# EAGLE design untitled (EAGLE 9.6.2)
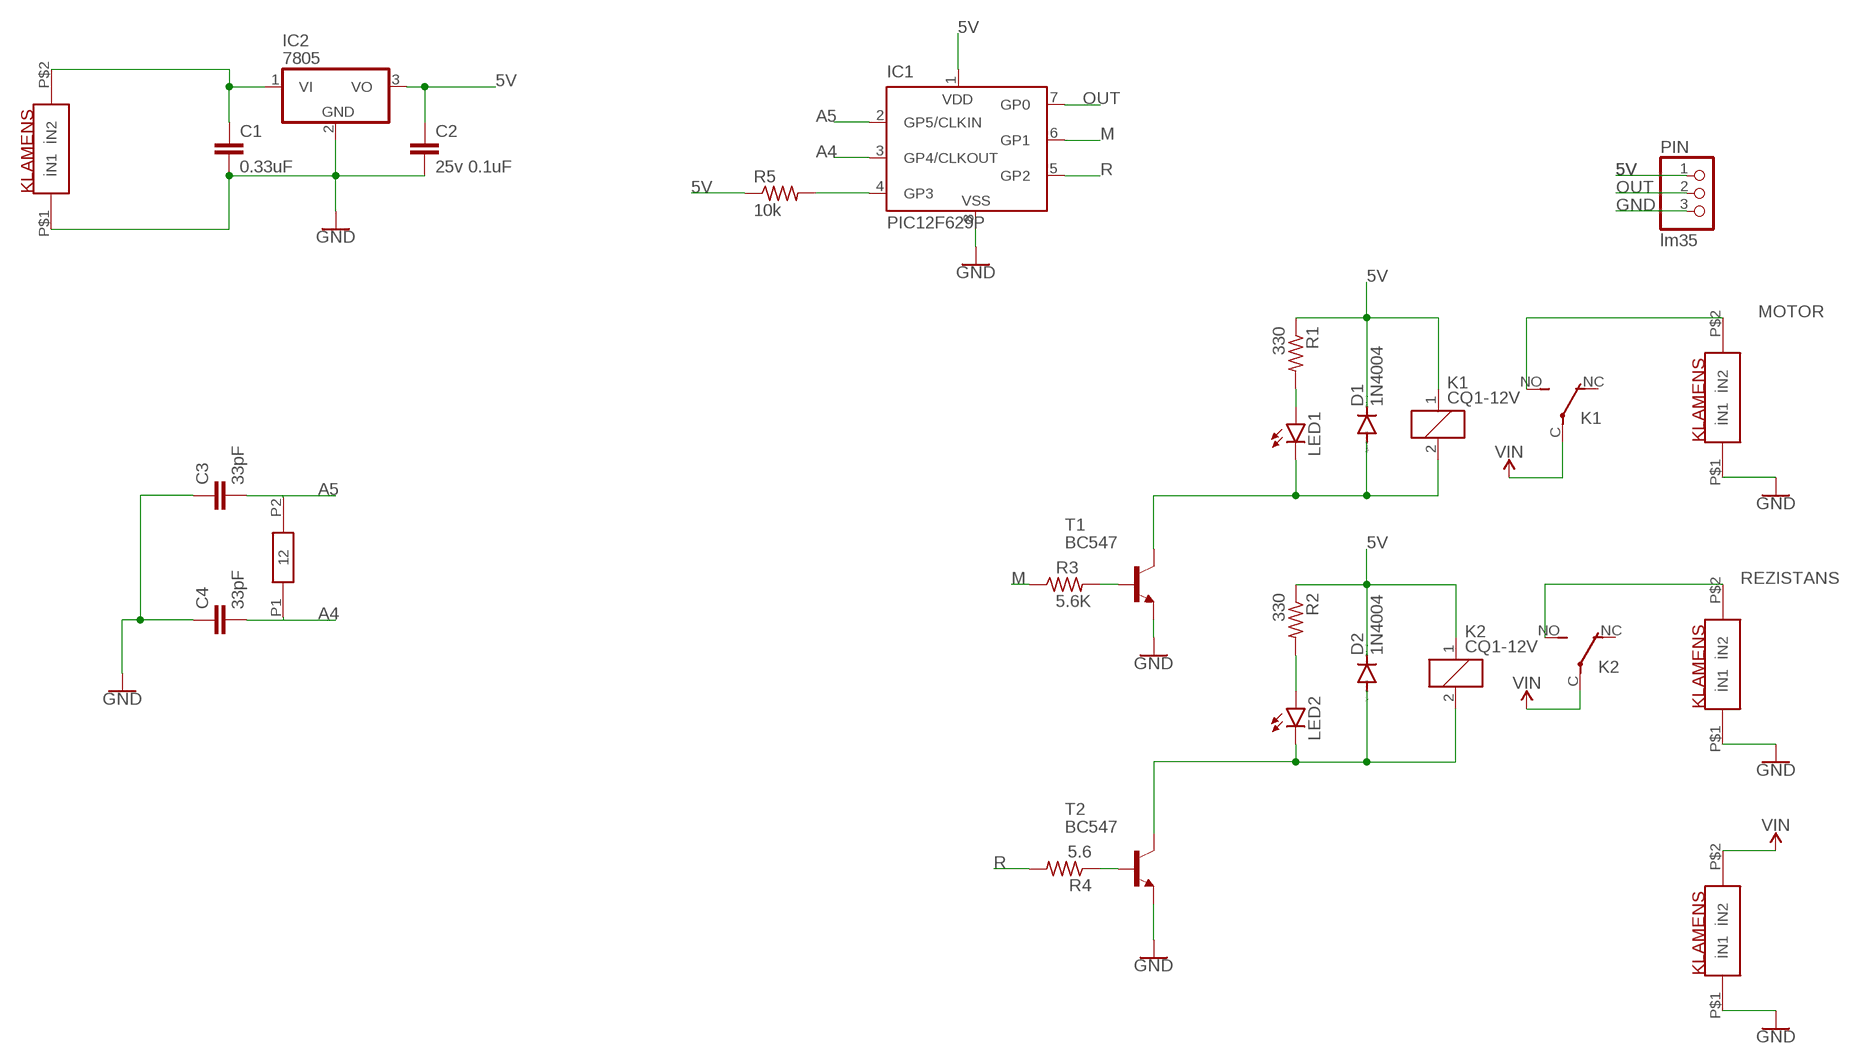
[diagram p0: schematic, sheet 1]

## Parts
C1  0.33uF  C2.5/6  [C2.5-6]
C2  25v 0.1uF  C2.5/6  [C2.5-6]
C3  33pF  C2.5/6  [C2.5-6]
C4  33pF  C2.5/6  [C2.5-6]
D1  1N4004  [DO41-10]
D2  1N4004  [DO41-10]
IC1  PIC12F629P  [DIL8]
IC2  7805  7808T  [TO220H]
K1  CQ1-12V  [CQ1]
K2  CQ1-12V  [CQ1]
LED1  LED3MM  [LED3MM]
LED2  LED3MM  [LED3MM]
PIN  lm35  PINHD-1X3  [1X03]
R1  330  R-US_0207/10  [0207/10]
R2  330  R-US_0207/10  [0207/10]
R3  5.6K  R-US_0207/10  [0207/10]
R4  5.6  R-US_0207/10  [0207/10]
R5  10k  R-US_0207/10  [0207/10]
T1  BC547  [TO92]
T2  BC547  [TO92]
U$1  KLAMENS  [KLAMENS]
U$2  KLAMENS  [KLAMENS]
U$3  KLAMENS  [KLAMENS]
U$5  KLAMENS  [KLAMENS]
U$6  KIRISTAL  [KIRISTAL]

## Nets
5V: C2.1 D1.C D2.C IC1.1(VDD) IC2.3(VO) K1.1 K2.1 PIN.1 R1.1 R2.1 R5.1
A4: C4.2 IC1.3(GP4/CLKOUT) U$6.P1
A5: C3.2 IC1.2(GP5/CLKIN) U$6.P2
GND: C1.2 C2.2 C3.1 C4.1 IC1.8(VSS) IC2.2(GND) PIN.3 T1.1(E) T2.1(E) U$1.P$1(İN1) U$2.P$1(İN1) U$3.P$1(İN1) U$5.P$1(İN1)
M: IC1.6(GP1) R3.1
MOTOR: K1.NO(2:S) U$1.P$2(İN2)
N$2: R3.2 T1.2(B)
N$4: LED2.A R2.2
N$5: D2.A K2.2 LED2.K(C) T2.3(C)
N$6: R4.1 T2.2(B)
N$7: LED1.A R1.2
N$8: D1.A K1.2 LED1.K(C) T1.3(C)
N$9: C1.1 IC2.1(VI) U$5.P$2(İN2)
N$10: IC1.4(GP3) R5.2
OUT: IC1.7(GP0) PIN.2
R: IC1.5(GP2) R4.2
REZISTANS: K2.NO(2:S) U$2.P$2(İN2)
VIN: K1.C(2:P) K2.C(2:P) U$3.P$2(İN2)
Unconnected: K1.NC(2:O) K2.NC(2:O)

## Library data of the parts
C1-C4 = capacitor-wima:C: CAPACITOR naming: grid - package width
D1 D2 = diode:1N4004: DIODE general purpose rectifier, 1 A
IC1 = microchip:PIC12F6*: Data Sheet 8-Pin FLASH-Based 8-Bit CMOS Microcontrollers Source: http://www.microchip.com .. 41190c.pdf; MF: MICROCHIP; MPN: PIC12F629-I/P; OC_FARNELL: 1292253; OC_NEWARK: 67K0822
IC2 = linear:78*: Positive VOLTAGE REGULATOR Source: http://cache.national.com/ds/LM/LM78L05.pdf http://www.fairchildsemi.com/ds/LM/LM7805.pdf
K1 K2 = relay:CQ1-12V: AUTOMOTIVE QUIET RELAY NAiS Source: http://www.mew-europe.com/.. en_ds_61208_0000.pdf; OC_FARNELL: unknown; OC_NEWARK: unknown
LED1 LED2 = led:LED: LED OSRAM: - CHIPLED LG R971, LG N971, LY N971, LG Q971, LY Q971, LO R971, LY R971 LH N974, LH R974 LS Q976, LO Q976, LY Q976 LO Q996 - Hyper CHIPLED LW Q18S LB Q993, LB Q99A, LB R99A - SideLED LS A670, LO A670, LY A670, LG A670, LP A670 LB A673, LV A673, LT A673, LW A673 LH A674 LY A675 LS A676, LA A676, LO A676, LY A676, LW A676 LS A679, LY A679, LG A679 - Hyper Micro SIDELED® LS Y876, LA Y876, LO Y876, LY Y876 LT Y87S - SmartLED LW L88C, LW L88S LB L89C, LB L89S, LG L890 LS L89K, LO L89K, LY L89K LS L896, LA L896, LO L896, LY L896 - TOPLED LS T670, LO T670, LY T670, LG T670, LP T670 LSG T670, LSP T670, LSY T670, LOP T670, LYG T670 LG T671, LOG T671, LSG T671 LB T673, LV T673, LT T673, LW T673 LH T674 LS T676, LA T676, LO T676, LY T676, LB T676, LH T676, LSB T676, LW T676 LB T67C, LV T67C, LT T67C, LS T67K, LO T67K, LY T67K, LW E67C LS E67B, LA E67B, LO E67B, LY E67B, LB E67C, LV E67C, LT E67C LW T67C LS T679, LY T679, LG T679 LS T770, LO T770, LY T770, LG T770, LP T770 LB T773, LV T773, LT T773, LW T773 LH T774 LS E675, LA E675, LY E675, LS T675 LS T776, LA T776, LO T776, LY T776, LB T776 LHGB T686 LT T68C, LB T68C - Hyper Mini TOPLED® LB M676 - Mini TOPLED Santana® LG M470 LS M47K, LO M47K, LY M47K Source: http://www.osram.convergy.de LUXEON: - LUMILED® LXK2-PW12-R00, LXK2-PW12-S00, LXK2-PW14-U00, LXK2-PW14-V00 LXK2-PM12-R00, LXK2-PM12-S00, LXK2-PM14-U00 LXK2-PE12-Q00, LXK2-PE12-R00, LXK2-PE12-S00, LXK2-PE14-T00, LXK2-PE14-U00 LXK2-PB12-K00, LXK2-PB12-L00, LXK2-PB12-M00, LXK2-PB14-N00, LXK2-PB14-P00, LXK2-PB14-Q00 LXK2-PR12-L00, LXK2-PR12-M00, LXK2-PR14-Q00, LXK2-PR14-R00 LXK2-PD12-Q00, LXK2-PD12-R00, LXK2-PD12-S00 LXK2-PH12-R00, LXK2-PH12-S00 LXK2-PL12-P00, LXK2-PL12-Q00, LXK2-PL12-R00 Source: www.luxeon.com KINGBRIGHT: KA-3528ASYC Source: www.kingbright.com
PIN = pinhead:PINHD-1X3: PIN HEADER
R1-R5 = rcl:R-US_: RESISTOR, American symbol; SPICEPREFIX: R
T1 T2 = transistor:BC547: NPN TRANSISTOR
U$1-U$3 U$5 = KLAMENS:KLAMENS
U$6 = ROBOT:KIRISTAL

## Board
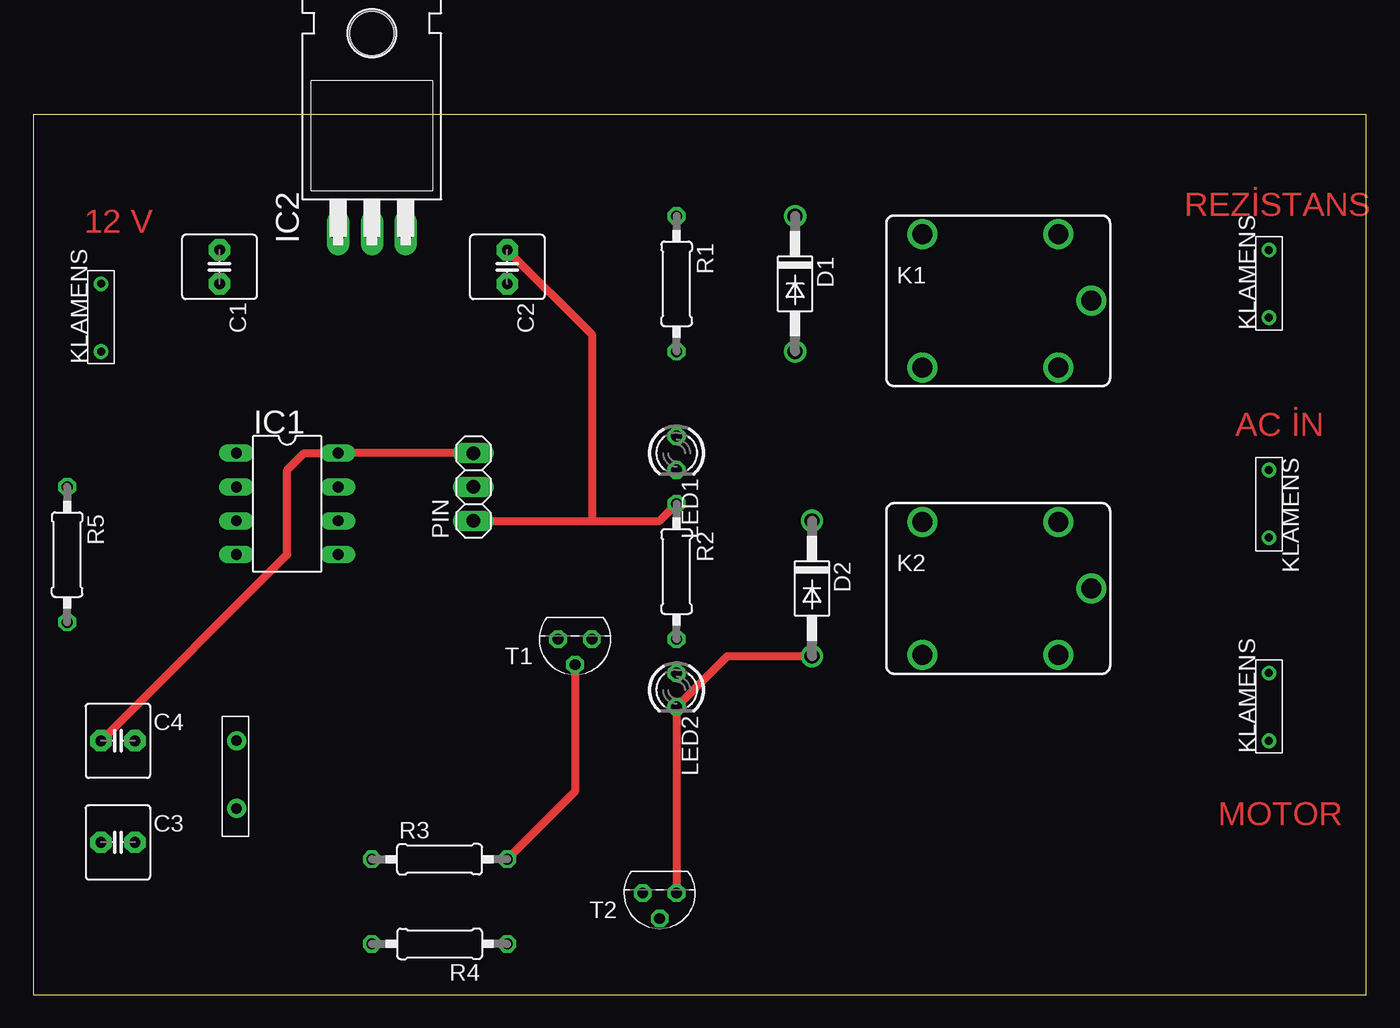
[diagram p1: board, top side]
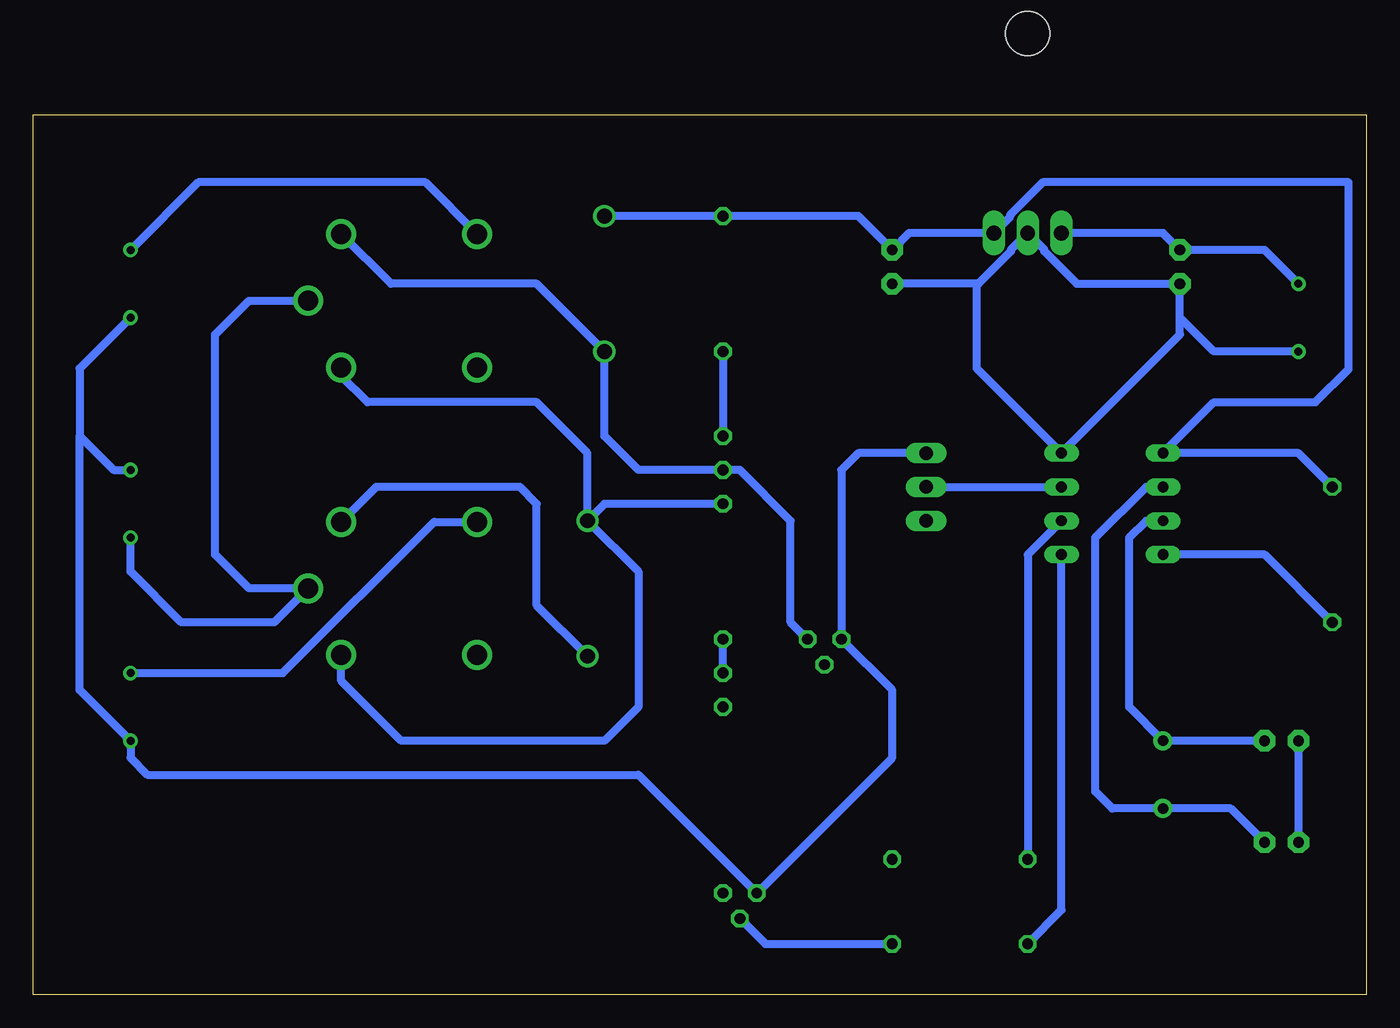
[diagram p2: board, bottom side, seen from below]

Size 100 x 66.03 mm. Coordinates in mm from the lower left corner, seen from the top.
Outline: 0,0 100,0 100,66.03 0,66.03 0,0
Copper layers (1*16): Top 0.035mm / dielectric 1.5mm / Bottom 0.035mm
Design rules "default": minimum track width 6mil, minimum drill 0.35mm, track to track 6mil, track to pad 6mil, pad to pad 6mil, via to via 6mil, smd to smd 6mil, copper to edge 40mil, drill to drill 6mil, minimum pad ring 10mil, minimum via ring 8mil, stop-mask expansion 4mil, vias tented up to drill 0mil, thermal gap 10mil

### Footprints (pad centres in the part's own frame; a part is rotated, then mirrored left to right if it is on the bottom)
C2.5-6 = drill 0.813 pad 1.6 octagon: 1 -1.27,0; 2 1.27,0
DO41-10 = drill 1.118: A 5.08,0; C -5.08,0
DIL8 = drill 0.813 long: 1 -3.81,-3.81; 2 -1.27,-3.81; 3 1.27,-3.81; 4 3.81,-3.81; 5 3.81,3.81; 6 1.27,3.81; 7 -1.27,3.81; 8 -3.81,3.81
TO220H = drill 1.118 long: 1 -2.54,-10.16; 2 0,-10.16; 3 2.54,-10.16 | hole 3.302: 0,4.826
CQ1 = drill 1.5: 1 4.5,-5; 2 4.5,5; C 7,0; NC -5.7,-5; NO -5.7,5
LED3MM = drill 0.813 octagon: A -1.27,0; K 1.27,0
1X03 = drill 1.016 long: 1 -2.54,0; 2 0,0; 3 2.54,0
0207/10 = drill 0.813 octagon: 1 -5.08,0; 2 5.08,0
TO92 = drill 0.813 octagon: 1 1.27,0; 2 0,1.905; 3 -1.27,0
KLAMENS = drill 0.6: P$1 -5.08,0; P$2 0,0
KIRISTAL = drill 0.8 pad 1.422: P1 -10.16,5.08; P2 -5.08,5.08

### Placement (x,y rotation side)
C1  13.97,54.61 270 top
C2  35.56,54.61 270 top
C3  6.35,11.43 0 top
C4  6.35,19.05 0 top
D1  57.15,53.34 270 top
D2  58.42,30.48 270 top
IC1  19.05,36.83 270 top
IC2  25.4,67.31 0 top
K1  72.39,52.07 0 top
K2  72.39,30.48 0 top
LED1  48.26,40.64 270 top
LED2  48.26,22.86 270 top
PIN  33.02,38.1 90 top
R1  48.26,53.34 270 top
R2  48.26,31.75 270 top
R3  30.48,10.16 0 top
R4  30.48,3.81 180 top
R5  2.54,33.02 270 top
T1  40.64,26.67 180 top
T2  46.99,7.62 180 top
U$1  92.71,55.88 90 top
U$2  92.71,24.13 90 top
U$3  92.71,34.29 270 top
U$5  5.08,53.34 90 top
U$6  10.16,8.89 270 top

### Tracks (layer width: path | path; a pad name or v marks a point on that pad's centre or on a via)
5V
  Top 0.61: PIN.1 41.91,35.56 | 41.91,35.56 46.99,35.56 R2.1 | C2.1 41.91,49.53 41.91,35.56
  Bottom 0.61: D1.C R1.1 38.1,58.42 C2.1 34.29,57.15 IC2.3 26.7,58.39 26.7,58.53 24.26,60.96 1.32,60.96 1.32,46.94 3.81,44.45 11.43,44.45 IC1.1 5.08,40.64 R5.1 | R2.1 57.15,36.83 D2.C | D2.C 58.42,40.64 62.23,44.45 74.93,44.45 76.89,46.41 K1.1 | D2.C 54.61,31.75 54.61,21.59 57.15,19.05 72.39,19.05 76.89,23.55 K2.1
A4
  Bottom 0.61: IC1.3 16.51,35.56 17.78,34.29 17.78,21.59 U$6.P1 C4.2
A5
  Bottom 0.61: IC1.2 16.51,38.1 20.32,34.29 20.32,15.24 19.05,13.97 U$6.P2 10.16,13.97 C3.2
GND
  Top 0.61: C4.1 19.05,33.02 19.05,39.37 20.32,40.64 IC1.8 PIN.3
  Bottom 0.61: U$5.P$1 11.43,48.26 13.97,50.8 C1.2 | C1.2 21.72,53.34 24.16,55.78 24.16,55.91 IC2.2 26.64,55.91 26.64,55.78 29.08,53.34 | 29.08,53.34 C2.2 | 29.08,53.34 29.21,53.21 29.21,46.99 IC1.8 13.97,49.53 C1.2 | U$1.P$1 96.52,46.99 96.52,41.91 | 96.52,41.91 93.98,39.37 U$3.P$1 | PIN.3 38.1,40.64 39.37,39.37 T1.1 35.56,22.86 35.56,17.78 T2.1 54.61,16.51 91.44,16.51 92.71,17.78 U$2.P$1 96.52,22.86 96.52,41.91 | C4.1 C3.1
M
  Bottom 0.61: IC1.6 25.4,33.02 R3.1
MOTOR
  Bottom 0.61: K1.NO 70.58,60.96 87.63,60.96 U$1.P$2
N$2
  Top 0.61: T1.2 40.64,15.24 R3.2
N$4
  Bottom 0.61: LED2.A R2.2
N$5
  Top 0.61: T2.3 LED2.K 52.07,25.4 D2.A
  Bottom 0.61: D2.A 62.23,29.21 62.23,36.83 63.5,38.1 74.27,38.1 K2.2
N$6
  Bottom 0.61: T2.2 45.09,3.81 R4.1
N$7
  Bottom 0.61: R1.2 LED1.A
N$8
  Bottom 0.61: K1.2 73.16,53.34 62.23,53.34 D1.A 57.15,41.91 54.61,39.37 LED1.K 46.99,39.37 43.18,35.56 43.18,27.94 T1.3
N$9
  Bottom 0.61: U$5.P$2 7.62,55.88 C1.1 15.24,57.15 IC2.1
N$10
  Bottom 0.61: R5.2 7.62,33.02 IC1.4
OUT
  Bottom 0.61: PIN.2 IC1.7
R
  Bottom 0.61: R4.2 22.86,6.35 IC1.5
REZISTANS
  Bottom 0.61: U$2.P$2 81.28,24.13 69.93,35.48 K2.NO
VIN
  Bottom 0.61: K1.C 83.82,52.07 86.36,49.53 86.36,33.02 83.82,30.48 K2.C 81.93,27.94 88.9,27.94 92.71,31.75 U$3.P$2

### Text on the board
Top: REZİSTANS | 12 V | AC İN | MOTOR